# EAGLE design QuadCopter (EAGLE 6.5.0)
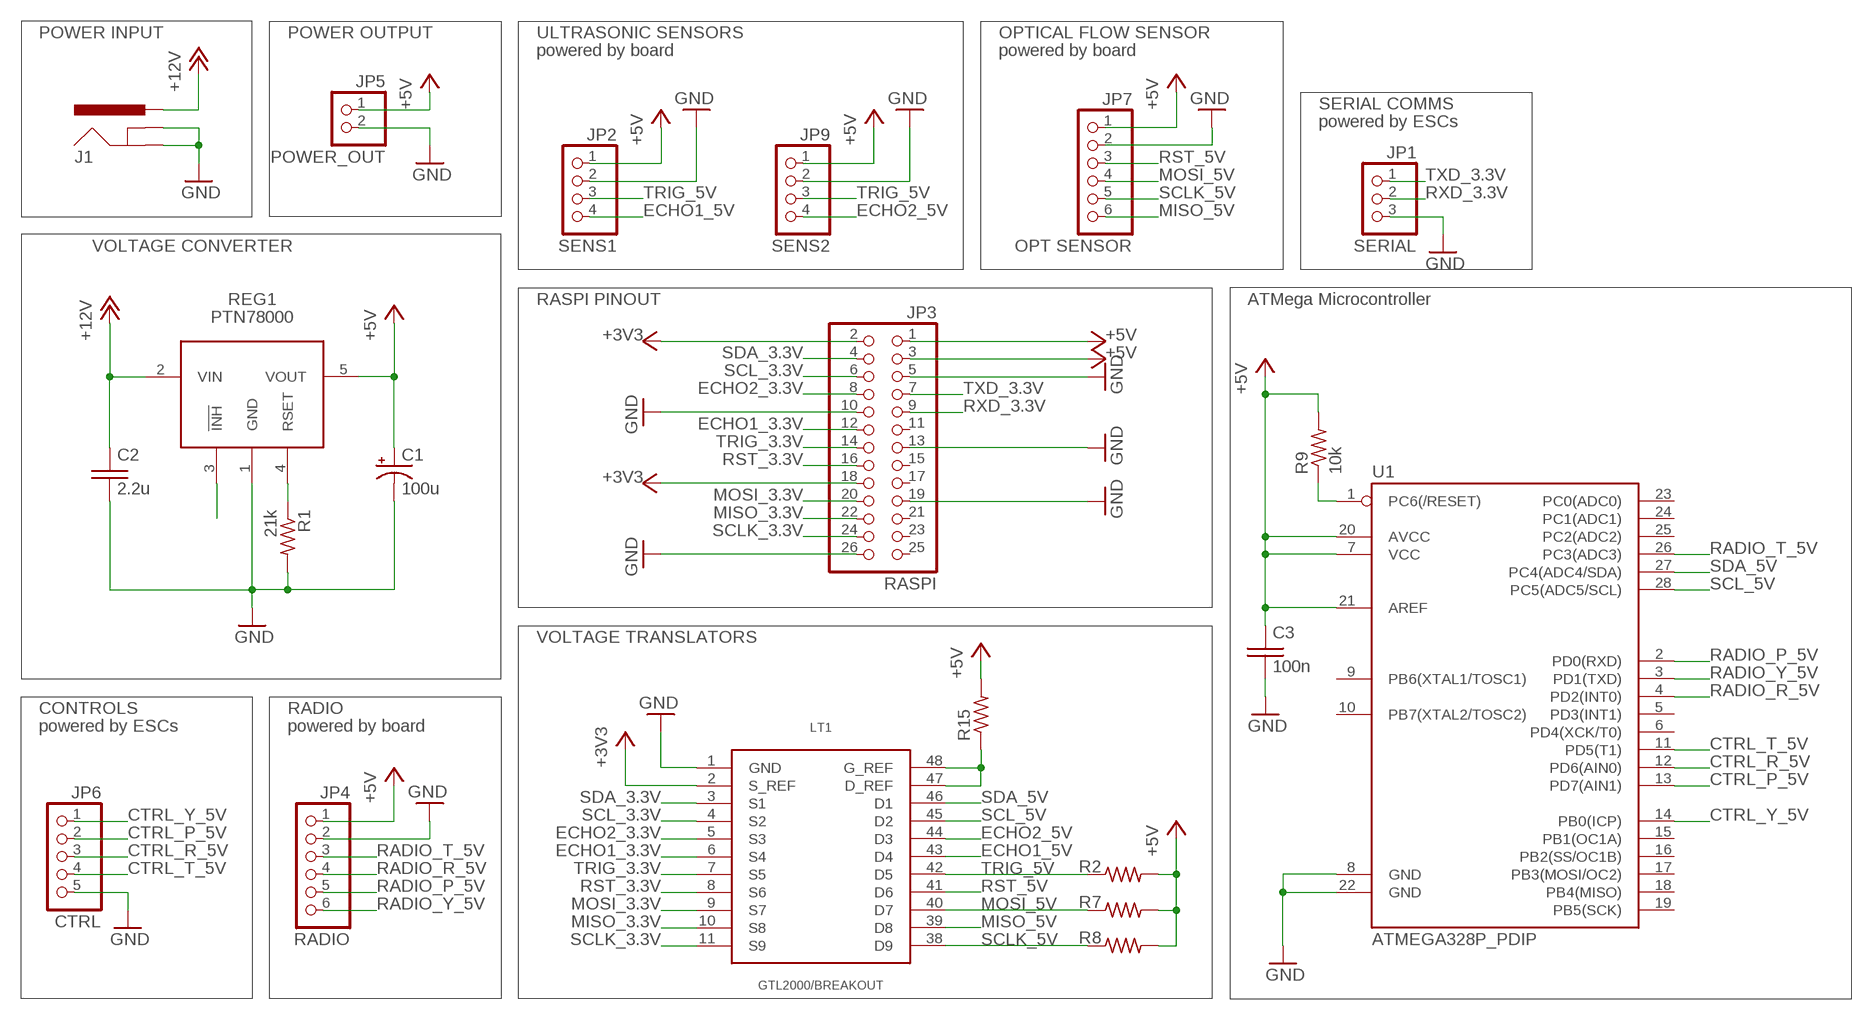
[diagram p0: schematic, sheet 1]

## Parts
C1  100u  CPOL-US153CLV-0605  [153CLV-0605]
C2  2.2u  C-US050-025X075  [C050-025X075]
C3  100n  C-US050-025X075  [C050-025X075]
J1  POWER_JACKSLT  [POWER_JACK_SLOT]
JP1  SERIAL  PINHD-1X3  [1X03]
JP2  SENS1  PINHD-1X4  [1X04]
JP3  RASPI  PINHD-2X13/SMD  [2X13/SMD]
JP4  RADIO  PINHD-1X6  [1X06]
JP5  POWER_OUT  PINHD-1X2  [1X02]
JP6  CTRL  PINHD-1X5  [1X05]
JP7  OPT SENSOR  PINHD-1X6  [1X06]
JP9  SENS2  PINHD-1X4  [1X04]
LT1  GTL2000/BREAKOUT  [TSSOP48/BREAKOUT]
R1  21k  R-US_0207/10  [0207/10]
R2  R-US_0207/12  [0207/12]
R7  R-US_0207/12  [0207/12]
R8  R-US_0207/12  [0207/12]
R9  10k  R-US_0207/10  [0207/10]
R15  R-US_0207/10  [0207/10]
REG1  PTN78000  [PTN78000]
U1  ATMEGA328P_PDIP  [DIL28-3]

## Nets
+3V3: JP3.2 JP3.18 LT1.2(S_REF)
+5V: C1.+ C3.1 JP2.1 JP3.1 JP3.3 JP4.1 JP5.1 JP7.1 JP9.1 R2.2 R7.2 R8.2 R9.2 R15.2 REG1.5(VOUT) U1.7(VCC) U1.20(AVCC) U1.21(AREF)
+12V: C2.1 J1.PWR REG1.2(VIN)
CTRL_P_5V: JP6.2 U1.13(PD7(AIN1))
CTRL_R_5V: JP6.3 U1.12(PD6(AIN0))
CTRL_T_5V: JP6.4 U1.11(PD5(T1))
CTRL_Y_5V: JP6.1 U1.14(PB0(ICP))
ECHO1_3.3V: JP3.12 LT1.6(S4)
ECHO1_5V: JP2.4 LT1.43(D4)
ECHO2_3.3V: JP3.8 LT1.5(S3)
ECHO2_5V: JP9.4 LT1.44(D3)
GND: C1.- C2.2 C3.2 J1.GND@1(GNDBREAK) J1.GND@2(GND) JP1.3 JP2.2 JP3.5 JP3.10 JP3.13 JP3.19 JP3.26 JP4.2 JP5.2 JP6.5 JP7.2 JP9.2 LT1.1(GND) R1.2 REG1.1(GND) U1.8(GND) U1.22(GND)
MISO_3.3V: JP3.22 LT1.10(S8)
MISO_5V: JP7.6 LT1.39(D8)
MOSI_3.3V: JP3.20 LT1.9(S7)
MOSI_5V: JP7.4 LT1.40(D7) R7.1
N$1: LT1.47(D_REF) LT1.48(G_REF) R15.1
N$2: R1.1 REG1.4(RSET)
N$3: REG1.3(!INH!)
N$5: R9.1 U1.1(PC6(/RESET))
RADIO_P_5V: JP4.5 U1.2(PD0(RXD))
RADIO_R_5V: JP4.4 U1.4(PD2(INT0))
RADIO_T_5V: JP4.3 U1.26(PC3(ADC3))
RADIO_Y_5V: JP4.6 U1.3(PD1(TXD))
RST_3.3V: JP3.16 LT1.8(S6)
RST_5V: JP7.3 LT1.41(D6)
RXD_3.3V: JP1.2 JP3.9
SCL_3.3V: JP3.6 LT1.4(S2)
SCL_5V: LT1.45(D2) U1.28(PC5(ADC5/SCL))
SCLK_3.3V: JP3.24 LT1.11(S9)
SCLK_5V: JP7.5 LT1.38(D9) R8.1
SDA_3.3V: JP3.4 LT1.3(S1)
SDA_5V: LT1.46(D1) U1.27(PC4(ADC4/SDA))
TRIG_3.3V: JP3.14 LT1.7(S5)
TRIG_5V: JP2.3 JP9.3 LT1.42(D5) R2.1
TXD_3.3V: JP1.1 JP3.7
Unconnected: JP3.11 JP3.15 JP3.17 JP3.21 JP3.23 JP3.25 U1.5(PD3(INT1)) U1.6(PD4(XCK/T0)) U1.9(PB6(XTAL1/TOSC1)) U1.10(PB7(XTAL2/TOSC2)) U1.15(PB1(OC1A)) U1.16(PB2(SS/OC1B)) U1.17(PB3(MOSI/OC2)) U1.18(PB4(MISO)) U1.19(PB5(SCK)) U1.23(PC0(ADC0)) U1.24(PC1(ADC1)) U1.25(PC2(ADC2))

## Notes on the sheet
- POWER INPUT | POWER OUTPUT | ULTRASONIC SENSORS | OPTICAL FLOW SENSOR
- powered by board | powered by board
- SERIAL COMMS
- powered by ESCs
- VOLTAGE CONVERTER
- RASPI PINOUT | ATMega Microcontroller
- VOLTAGE TRANSLATORS
- CONTROLS | RADIO
- powered by ESCs | powered by board

## Library data of the parts
C1 = rcl:CPOL-US: POLARIZED CAPACITOR, American symbol
C2 C3 = rcl:C-US: CAPACITOR, American symbol
J1 = SparkFun-Connectors:POWER_JACK: Power Jack This is the standard 5.5mm barrel jack for power. The PTH is the most common, proven, reliable, footprint. The Slot footprint only works if the mill layer is transmitted to the PCB fab house so be warned. Mating wall wart : TOL-00298 (and others); PROD_ID: PRT-00119
JP1 = pinhead:PINHD-1X3: PIN HEADER
JP2 JP9 = pinhead:PINHD-1X4: PIN HEADER
JP3 = pinhead:PINHD-2X13: PIN HEADER
JP4 JP7 = pinhead:PINHD-1X6: PIN HEADER
JP5 = pinhead:PINHD-1X2: PIN HEADER
JP6 = pinhead:PINHD-1X5: PIN HEADER
LT1 = philips-semiconductors:GTL2000
R1 R2 R7-R9 R15 = rcl:R-US_: RESISTOR, American symbol
REG1 = texas:PTN78000: 1.5-A, WIDE-INPUT ADJUSTABLE SWITCHING REGULATOR
U1 = SparkFun-DigitalIC:ATMEGA328P_PDIP: uC used in the Arduino 32kb flash, 1k EEPROM, 2k SRAM This is the through-hole version of this chip.

## Board
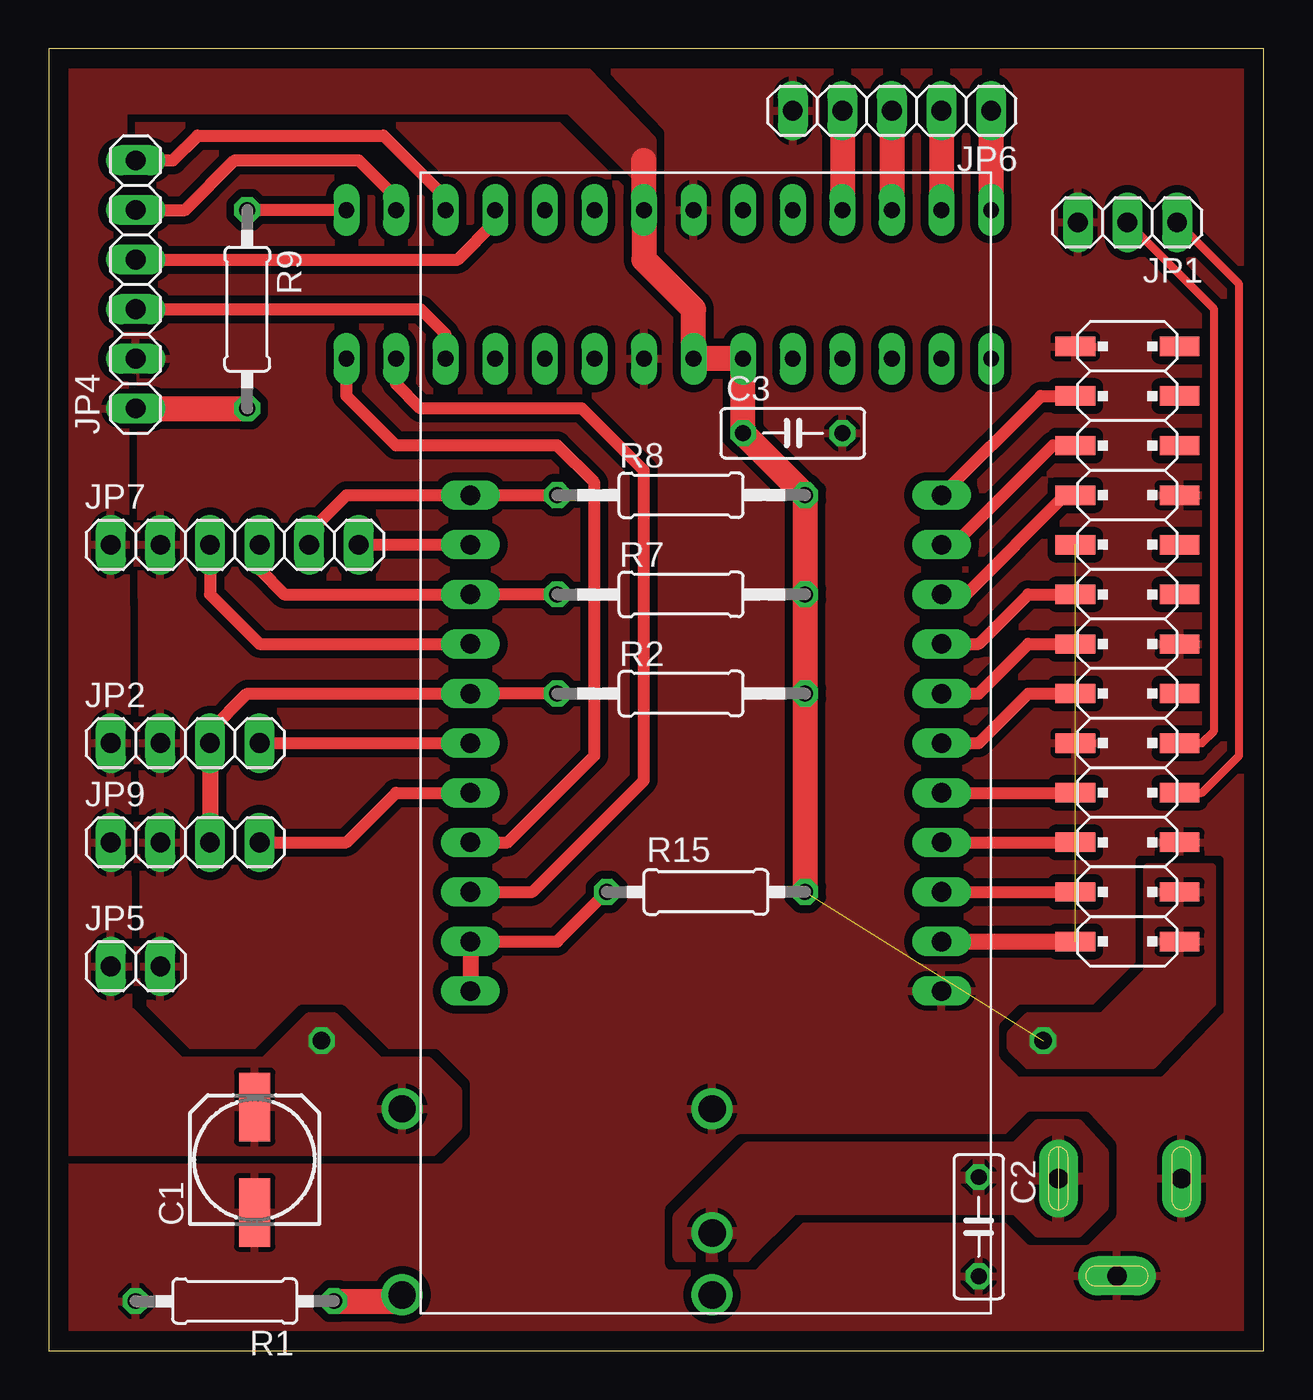
[diagram p1: board, top side]
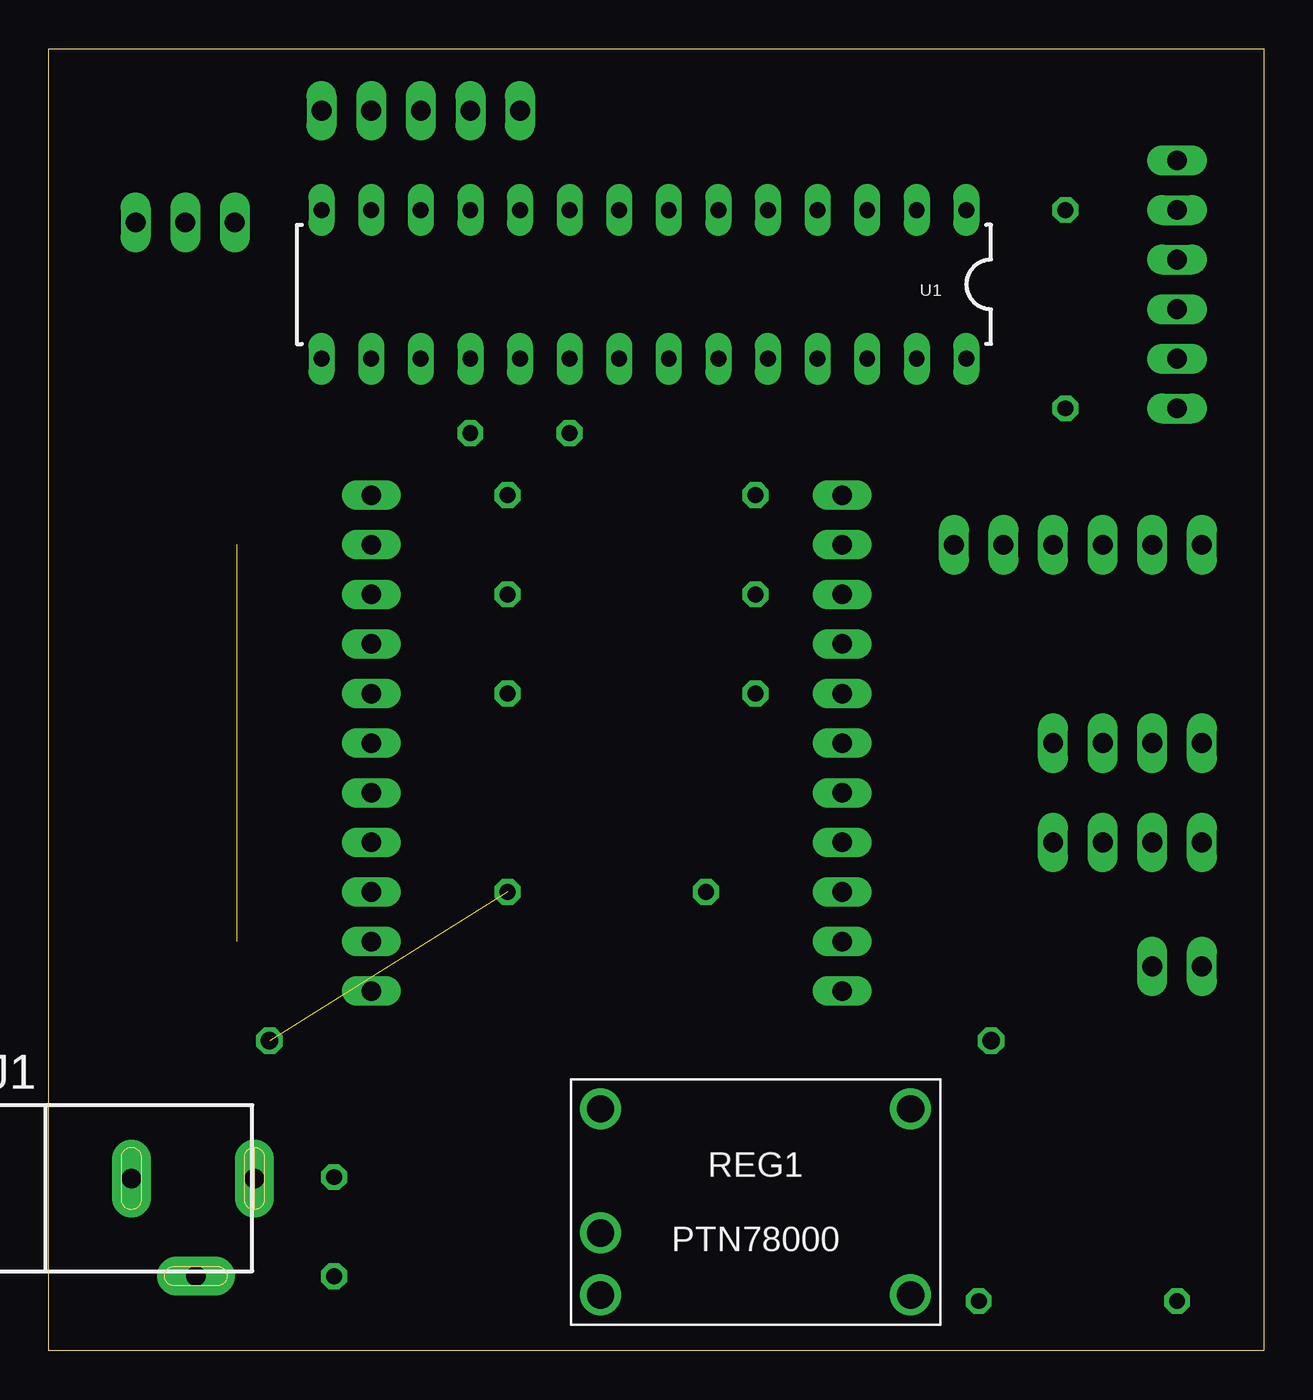
[diagram p2: board, bottom side, seen from below]

Size 62.23 x 66.67 mm. Coordinates in mm from the lower left corner, seen from the top.
Outline: 0,0 62.23,0 62.23,66.67 0,66.67 0,0
Copper layers (1*16): Top 0.035mm / dielectric 1.5mm / Bottom 0.035mm
Design rules "default *": minimum track width 12mil, minimum drill 20mil, track to track 8mil, track to pad 8mil, pad to pad 8mil, via to via 8mil, smd to smd 8mil, copper to edge 40mil, drill to drill 8mil, minimum pad ring 10mil, minimum via ring 8mil, stop-mask expansion 4mil, vias tented up to drill 0mil, thermal gap 10mil

### Footprints (pad centres in the part's own frame; a part is rotated, then mirrored left to right if it is on the bottom)
153CLV-0605 = smd 3.5 x 1.6: + 2.7,0; - -2.7,0
C050-025X075 = drill 0.813 octagon: 1 -2.54,0; 2 2.54,0
POWER_JACK_SLOT = drill 1 pad 2 long: GND@1 3.75,7.4; GND@2 8.75,10.7; PWR 3.75,13.7
1X03 = drill 1.016 long: 1 -2.54,0; 2 0,0; 3 2.54,0
1X04 = drill 1.016 long: 1 -3.81,0; 2 -1.27,0; 3 1.27,0; 4 3.81,0
2X13/SMD = smd 0.991 x 2.032: 1 1.27,-0.127; 2 1.27,5.207; 3 3.81,-0.127; 4 3.81,5.207; 5 6.35,-0.127; 6 6.35,5.207; 7 8.89,-0.127; 8 8.89,5.207; 9 11.43,-0.127; 10 11.43,5.207; 11 13.97,-0.127; 12 13.97,5.207; 13 16.51,-0.127; 14 16.51,5.207; 15 19.05,-0.127; 16 19.05,5.207; 17 21.59,-0.127; 18 21.59,5.207; 19 24.13,-0.127; 20 24.13,5.207; 21 26.67,-0.127; 22 26.67,5.207; 23 29.21,-0.127; 24 29.21,5.207; 25 31.75,-0.127; 26 31.75,5.207
1X06 = drill 1.016 long: 1 -6.35,0; 2 -3.81,0; 3 -1.27,0; 4 1.27,0; 5 3.81,0; 6 6.35,0
1X02 = drill 1.016 long: 1 -1.27,0; 2 1.27,0
1X05 = drill 1.016 long: 1 -5.08,0; 2 -2.54,0; 3 0,0; 4 2.54,0; 5 5.08,0
TSSOP48/BREAKOUT = drill 1 long: 1 -12.7,-12.065; 2 -10.16,-12.065; 3 -7.62,-12.065; 4 -5.08,-12.065; 5 -2.54,-12.065; 6 0,-12.065; 7 2.54,-12.065; 8 5.08,-12.065; 9 7.62,-12.065; 10 10.16,-12.065; 11 12.7,-12.065; 38 12.7,12.065; 39 10.16,12.065; 40 7.62,12.065; 41 5.08,12.065; 42 2.54,12.065; 43 0,12.065; 44 -2.54,12.065; 45 -5.08,12.065; 46 -7.62,12.065; 47 -10.16,12.065; 48 -12.7,12.065
0207/10 = drill 0.813 octagon: 1 -5.08,0; 2 5.08,0
0207/12 = drill 0.813 octagon: 1 -6.35,0; 2 6.35,0
PTN78000 = drill 1.4: 1 -7.938,4.763; 2 -7.938,-1.587; 3 -7.938,-4.763; 4 7.938,-4.763; 5 7.938,4.763
DIL28-3 = drill 0.813 long: 1 -16.51,-3.81; 2 -13.97,-3.81; 3 -11.43,-3.81; 4 -8.89,-3.81; 5 -6.35,-3.81; 6 -3.81,-3.81; 7 -1.27,-3.81; 8 1.27,-3.81; 9 3.81,-3.81; 10 6.35,-3.81; 11 8.89,-3.81; 12 11.43,-3.81; 13 13.97,-3.81; 14 16.51,-3.81; 15 16.51,3.81; 16 13.97,3.81; 17 11.43,3.81; 18 8.89,3.81; 19 6.35,3.81; 20 3.81,3.81; 21 1.27,3.81; 22 -1.27,3.81; 23 -3.81,3.81; 24 -6.35,3.81; 25 -8.89,3.81; 26 -11.43,3.81; 27 -13.97,3.81; 28 -16.51,3.81

### Placement (x,y rotation side)
C1  10.54,9.78 90 top
C2  47.62,6.35 270 top
C3  38.1,46.99 0 top
J1  65.41,12.57 270 bottom
JP1  55.24,57.78 180 top
JP2  6.99,31.11 0 top
JP3  57.78,19.68 90 top
JP4  4.45,54.61 90 top
JP5  4.45,19.68 0 top
JP6  43.18,63.5 180 top
JP7  9.53,41.27 0 top
JP9  6.99,26.04 0 top
LT1  33.66,31.11 90 top
R1  9.53,2.54 180 top
R2  32.38,33.66 0 top
R7  32.38,38.73 0 top
R8  32.38,43.81 0 top
R9  10.16,53.34 270 top
R15  33.66,23.5 0 top
REG1  26.04,7.62 0 bottom
U1  31.75,54.61 180 bottom

### Tracks (layer width: path | path; a pad name or v marks a point on that pad's centre or on a via)
+3V3  (1 unrouted)
  Top 0.813: LT1.2 JP3.2
+5V  (via drill 0.9)  (1 unrouted)
  Top 1.27: R15.2 R2.2 R7.2 R8.2 C3.1 U1.20 U1.21 33.02,53.34 30.48,55.88 U1.7 30.48,60.96 | JP4.1 R9.2
  other vias: 50.93,15.88 13.97,15.88
  pour Top (isolate 0.406): 0,66.67 26.47,66.67 30.91,62.03 30.91,60.2 29.97,60.2 26.67,63.5 3.81,63.5 4.06,17.4 4.19,17.4 6.73,14.86 11.05,14.86 13.34,17.14 14.61,17.14 16.92,14.86 19.43,14.86 20.95,13.34 20.95,11.43 19.68,10.16 0,10.16
  pour Top (isolate 0.406): 56.26,24.77 59.56,24.77 59.56,17.78 56.52,14.61 50.16,14.61 49.28,15.49 49.28,16.26 50.16,17.14 53.98,17.14 56.26,19.43
+12V
  pour Top (isolate 0.406): 35.81,10.41 49.53,10.41 50.67,11.56 52.7,11.56 53.98,10.16 53.98,7.37 52.7,6.1 50.67,6.1 49.53,7.24 38.1,7.24 35.69,4.83 32.26,4.83 32.26,6.86
CTRL_P_5V
  Top 1.27: JP6.2 U1.13
CTRL_R_5V
  Top 1.27: JP6.3 U1.12
CTRL_T_5V
  Top 1.27: JP6.4 U1.11
CTRL_Y_5V
  Top 1.27: JP6.1 U1.14
ECHO1_3.3V
  Top 0.61: LT1.6 47.62,31.11 50.16,33.66 JP3.12
ECHO1_5V
  Top 0.61: JP2.4 LT1.43
ECHO2_3.3V
  Top 0.61: LT1.5 JP3.8
ECHO2_5V
  Top 0.61: JP9.4 15.24,26.04 17.78,28.57 LT1.44
GND
  pour Top (isolate 0.406, rank 2): 62.23,66.67 62.23,0 0,0 0,66.67
MISO_3.3V
  Top 0.61: LT1.10 46.35,41.27 51.44,46.35 JP3.22
MISO_5V
  Top 0.61: JP7.6 LT1.39
MOSI_3.3V
  Top 0.61: LT1.9 46.99,38.73 52.07,43.81 JP3.20
MOSI_5V
  Top 0.61: JP7.4 10.79,40.01 12.06,38.73 LT1.40 R7.1
N$1
  Top 0.61: LT1.47 26.04,20.95 R15.1
  Top 0.813: LT1.47 LT1.48
N$2
  Top 1.27: R1.1 17.78,2.54 REG1.4
N$5
  Top 0.61: U1.1 R9.1
RADIO_P_5V
  Top 0.61: JP4.5 6.99,58.42 9.53,60.96 15.88,60.96 17.78,59.05 U1.2
RADIO_R_5V
  Top 0.61: JP4.4 20.95,55.88 22.86,57.78 U1.4
RADIO_T_5V
  Top 0.61: JP4.3 19.05,53.34 20.32,52.07 U1.26
RADIO_Y_5V
  Top 0.61: JP4.6 6.35,60.96 7.62,62.23 17.14,62.23 20.32,59.05 U1.3
RST_3.3V
  Top 0.61: LT1.8 47.62,36.2 50.16,38.73 JP3.16
RST_5V
  Top 0.61: JP7.3 8.26,38.73 10.79,36.2 LT1.41
RXD_3.3V
  Top 0.406: JP3.9 59.05,31.11 59.69,31.75 59.69,53.34 JP1.2
SCL_3.3V
  Top 0.61: LT1.4 JP3.6
SCL_5V
  Top 0.61: U1.28 15.24,48.9 17.78,46.35 26.04,46.35 27.94,44.45 27.94,30.48 23.5,26.04 LT1.45
SCLK_3.3V
  Top 0.61: LT1.11 50.8,48.9 JP3.24
SCLK_5V
  Top 0.61: JP7.5 13.34,41.91 15.24,43.81 LT1.38 R8.1
SDA_3.3V
  Top 0.61: LT1.3 JP3.4
SDA_5V
  Top 0.61: LT1.46 24.77,23.5 30.48,29.21 30.48,45.09 27.3,48.26 19.05,48.26 17.78,49.53 U1.27
TRIG_3.3V
  Top 0.61: LT1.7 47.62,33.66 50.16,36.2 JP3.14
TRIG_5V
  Top 0.61: JP2.3 8.26,31.75 10.16,33.66 LT1.42 R2.1
  Top 0.813: JP2.3 JP9.3
TXD_3.3V
  Top 0.406: JP3.7 59.05,28.57 60.96,30.48 60.96,54.61 JP1.1